# Altium schematic sheet IDC_MCX_Adapter.SchDoc: IDC MCX Adapter
size A3; CheckedBy: Maciej Przybysz; Author: Michał Piętka; Organization: Technosystem; Address1: Słoneczna 125, 05-506 Kolonia Lesznowola; Address2: https://technosystem.pl/; Address4: (NOT USED); DocumentNumber: 1; Revision: 0; SheetNumber: 1; SheetTotal: 1
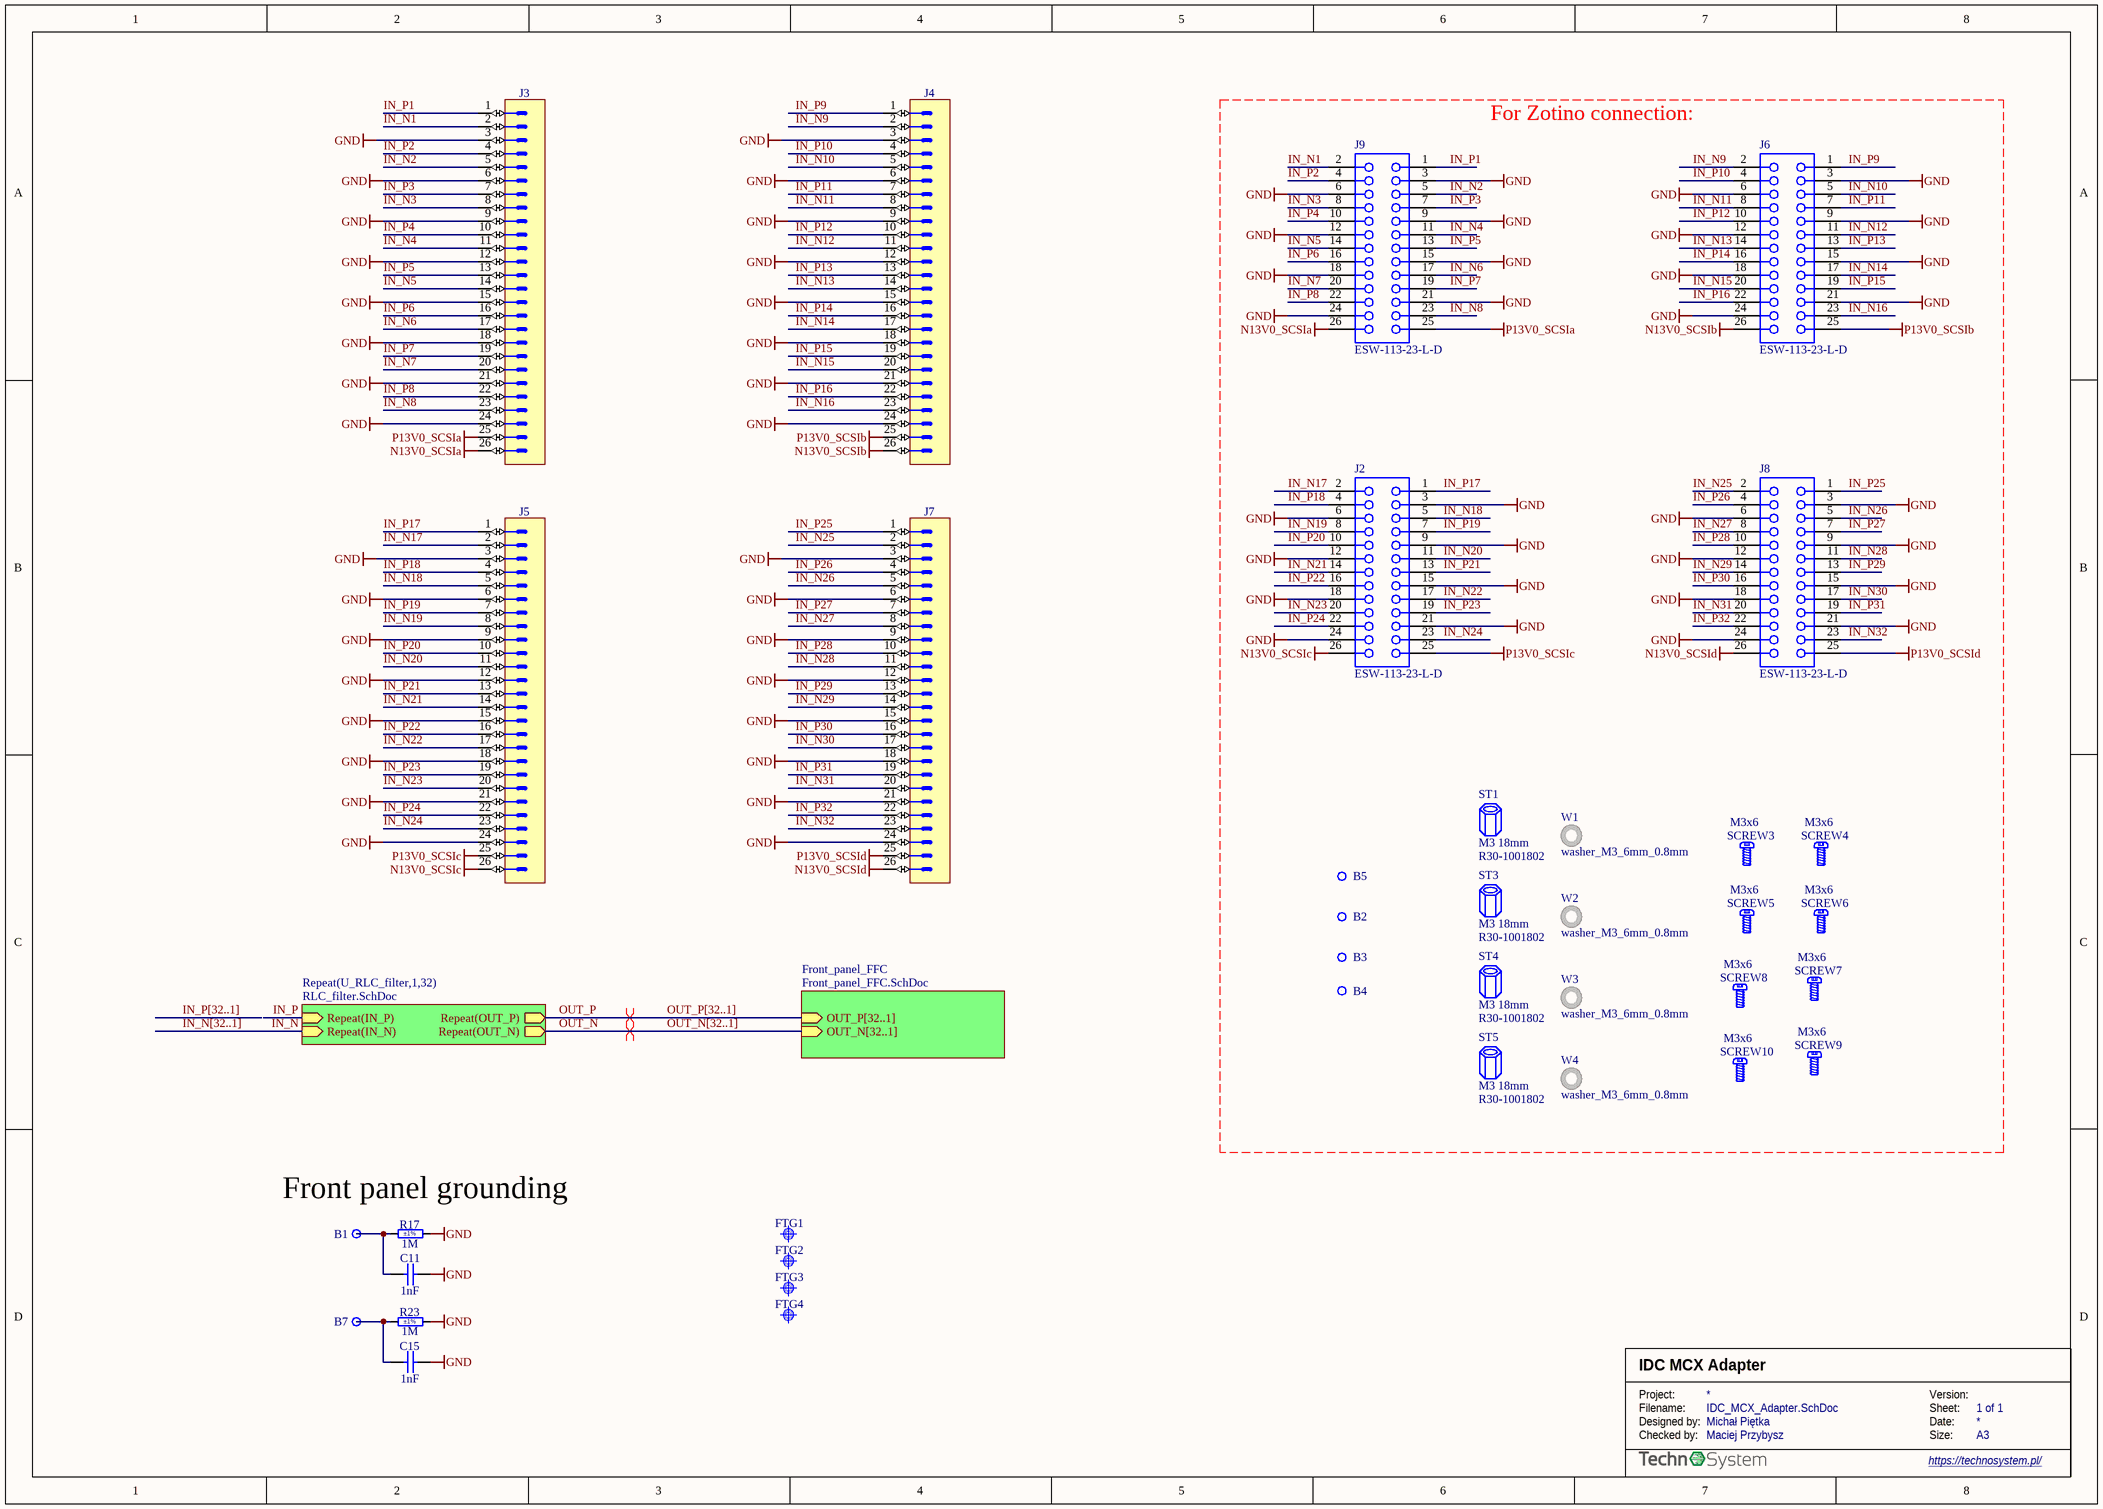
[diagram p0: IDC_MCX_Adapter.SchDoc]

## Parts
B1  Plated Hole  [MTG270_500]  (value not drawn)  (no BOM)
B2  Plated Hole  [MTG320_700]  (value not drawn)  (no BOM)
B3  Plated Hole  [MTG320_700]  (value not drawn)  (no BOM)
B4  Plated Hole  [MTG320_700]  (value not drawn)  (no BOM)
B5  Plated Hole  [MTG320_700]  (value not drawn)  (no BOM)
B7  Plated Hole  [MTG270_500]  (value not drawn)  (no BOM)
C11  1nF  [CAPC1608X87N]
C15  1nF  [CAPC1608X87N]
FTG1  Use only in PCB  [FIDUCIAL_TOP_C100-200]  (value not drawn)
FTG2  Use only in PCB  [FIDUCIAL_TOP_S100-200]  (value not drawn)
FTG3  Use only in PCB  [FIDUCIAL_TOP_S100-200]  (value not drawn)
FTG4  Use only in PCB  [FIDUCIAL_TOP_S100-200]  (value not drawn)
J2  ESW-113-23-L-D  [SMTC-ESW-113-23-X-D]
J3  Header 26  [3M_N2526-6002RB]  (value not drawn)
J4  Header 26  [3M_N2526-6002RB]  (value not drawn)
J5  Header 26  [3M_N2526-6002RB]  (value not drawn)
J6  ESW-113-23-L-D  [SMTC-ESW-113-23-X-D]
J7  Header 26  [3M_N2526-6002RB]  (value not drawn)
J8  ESW-113-23-L-D  [SMTC-ESW-113-23-X-D]
J9  ESW-113-23-L-D  [SMTC-ESW-113-23-X-D]
R17  1M  Tolerance: ±1%  [RESC1608X55N]
R23  1M  Tolerance: ±1%  [RESC1608X55N]
SCREW3  M3x6  [BOSSARD_BN5687-3061605_v]
SCREW4  M3x6  [BOSSARD_BN5687-3061605_v]
SCREW5  M3x6  [BOSSARD_BN5687-3061605_v]
SCREW6  M3x6  [BOSSARD_BN5687-3061605_v]
SCREW7  M3x6  [BOSSARD_BN5687-3061605_v]
SCREW8  M3x6  [BOSSARD_BN5687-3061605_v]
SCREW9  M3x6  [BOSSARD_BN5687-3061605_v]
SCREW10  M3x6  [BOSSARD_BN5687-3061605_v]
ST1  M3 18mm  [R30-1001802]
ST3  M3 18mm  [R30-1001802]
ST4  M3 18mm  [R30-1001802]
ST5  M3 18mm  [R30-1001802]
W1  washer_M3_6mm_0.8mm  [washer_M3_6mm_0.8mm]
W2  washer_M3_6mm_0.8mm  [washer_M3_6mm_0.8mm]
W3  washer_M3_6mm_0.8mm  [washer_M3_6mm_0.8mm]
W4  washer_M3_6mm_0.8mm  [washer_M3_6mm_0.8mm]

## Sub-sheets
Front_panel_FFC = Front_panel_FFC.SchDoc: OUT_P[32..1] (in), OUT_N[32..1] (in)
Repeat(U_RLC_filter,1,32) = RLC_filter.SchDoc: Repeat(IN_P) (in), Repeat(IN_N) (in), Repeat(OUT_P) (out), Repeat(OUT_N) (out)

## Nets
GND: C11.2 C15.2 J2.3 J2.6 J2.9 J2.12 J2.15 J2.18 J2.21 J2.24 J3.3 J3.6 J3.9 J3.12 J3.15 J3.18 J3.21 J3.24 J4.3 J4.6 J4.9 J4.12 J4.15 J4.18 J4.21 J4.24 J5.3 J5.6 J5.9 J5.12 J5.15 J5.18 J5.21 J5.24 J6.3 J6.6 J6.9 J6.12 J6.15 J6.18 J6.21 J6.24 J7.3 J7.6 J7.9 J7.12 J7.15 J7.18 J7.21 J7.24 J8.3 J8.6 J8.9 J8.12 J8.15 J8.18 J8.21 J8.24 J9.3 J9.6 J9.9 J9.12 J9.15 J9.18 J9.21 J9.24 R17.2 R23.2
N13V0_SCSIa: J3.26 J9.26
N13V0_SCSIb: J4.26 J6.26
N13V0_SCSIc: J2.26 J5.26
N13V0_SCSId: J7.26 J8.26
P13V0_SCSIa: J3.25 J9.25
P13V0_SCSIb: J4.25 J6.25
P13V0_SCSIc: J2.25 J5.25
P13V0_SCSId: J7.25 J8.25
IN_N: sheet Repeat(U_RLC_filter,1,32)/Repeat(IN_N)
IN_N1: J3.2 J9.2
IN_N2: J3.5 J9.5
IN_N3: J3.8 J9.8
IN_N4: J3.11 J9.11
IN_N5: J3.14 J9.14
IN_N6: J3.17 J9.17
IN_N7: J3.20 J9.20
IN_N8: J3.23 J9.23
IN_N9: J4.2 J6.2
IN_N10: J4.5 J6.5
IN_N11: J4.8 J6.8
IN_N12: J4.11 J6.11
IN_N13: J4.14 J6.14
IN_N14: J4.17 J6.17
IN_N15: J4.20 J6.20
IN_N16: J4.23 J6.23
IN_N17: J2.2 J5.2
IN_N18: J2.5 J5.5
IN_N19: J2.8 J5.8
IN_N20: J2.11 J5.11
IN_N21: J2.14 J5.14
IN_N22: J2.17 J5.17
IN_N23: J2.20 J5.20
IN_N24: J2.23 J5.23
IN_N25: J7.2 J8.2
IN_N26: J7.5 J8.5
IN_N27: J7.8 J8.8
IN_N28: J7.11 J8.11
IN_N29: J7.14 J8.14
IN_N30: J7.17 J8.17
IN_N31: J7.20 J8.20
IN_N32: J7.23 J8.23
IN_P: sheet Repeat(U_RLC_filter,1,32)/Repeat(IN_P)
IN_P1: J3.1 J9.1
IN_P2: J3.4 J9.4
IN_P3: J3.7 J9.7
IN_P4: J3.10 J9.10
IN_P5: J3.13 J9.13
IN_P6: J3.16 J9.16
IN_P7: J3.19 J9.19
IN_P8: J3.22 J9.22
IN_P9: J4.1 J6.1
IN_P10: J4.4 J6.4
IN_P11: J4.7 J6.7
IN_P12: J4.10 J6.10
IN_P13: J4.13 J6.13
IN_P14: J4.16 J6.16
IN_P15: J4.19 J6.19
IN_P16: J4.22 J6.22
IN_P17: J2.1 J5.1
IN_P18: J2.4 J5.4
IN_P19: J2.7 J5.7
IN_P20: J2.10 J5.10
IN_P21: J2.13 J5.13
IN_P22: J2.16 J5.16
IN_P23: J2.19 J5.19
IN_P24: J2.22 J5.22
IN_P25: J7.1 J8.1
IN_P26: J7.4 J8.4
IN_P27: J7.7 J8.7
IN_P28: J7.10 J8.10
IN_P29: J7.13 J8.13
IN_P30: J7.16 J8.16
IN_P31: J7.19 J8.19
IN_P32: J7.22 J8.22
OUT_N: sheet Repeat(U_RLC_filter,1,32)/Repeat(OUT_N)
OUT_P: sheet Repeat(U_RLC_filter,1,32)/Repeat(OUT_P)
NetB1_1: B1.1 C11.1 R17.1
NetB7_1: B7.1 C15.1 R23.1

Not connected (* = marked no-connect by the designer): B2 1; B3 1; B4 1; B5 1

## Buses and harness runs
bus IN_N[32..1]
bus IN_P[32..1]
bus OUT_N[32..1] = sheet Front_panel_FFC/OUT_N[32..1]
bus OUT_P[32..1] = sheet Front_panel_FFC/OUT_P[32..1]

## Layout directives
differential pair: OUT_N, OUT_P

## Notes on the sheet
- (near J6) For Zotino connection:
- Front panel grounding
- Project:
- Version:
- Designed by:
- Checked by:
- Filename:
- Size:
- Date:
- Sheet:
- A3

## Library data of the parts
B1 B7 = PLATED_HOLE2.7_PAD5.0: Single Terminal Socket; Part Description: Plated Through Hole: Hole Dia.=2.7mm Pad Dia.=5.0mm; Mounted: No; Part Number: PLATED_HOLE2.7_PAD5.0; Component Type: Standard (No BOM); Pin Count: 1; Family: Plated Hole; Socket: No; SMD: No; Sense: No; Status: None; ComponentHeight: 0mm; HelpURL: Undefined; Author: CERN DEM JMW; CreateDate: 27.09.2011; LatestRevisionDate: 27.09.2011; PackageDescription: Plated Through Hole: Hole Dia.=2.7mm Pad Dia.=5.0mm
B2-B5 = PLATED_HOLE3.2_PAD7.0: Single Terminal Socket; Part Description: Plated Through Hole: Hole Dia.=3.2mm Pad Dia.=7.0mm; Mounted: No; Part Number: PLATED_HOLE3.2_PAD7.0; Component Type: Standard (No BOM); Pin Count: 1; Family: Plated Hole; Socket: No; SMD: No; Sense: No; Status: None; ComponentHeight: 0mm; HelpURL: Undefined; Author: CERN DEM JMW; CreateDate: 28.11.2017; LatestRevisionDate: 28.11.2017; PackageDescription: Plated Through Hole: Hole Dia.=3.2mm Pad Dia.=7.0mm
C11 C15 = CC0603_1NF_50V_10%_X7R: Non-polarised capacitor; Part Description: SMD Multilayer Chip Ceramic Capacitor; Manufacturer: GENERIC; Manufacturer1 Part Number: 223858615623; Voltage: 50V; TC: X7R; Tolerance: ±10%; Part Number: CC0603_1NF_50V_10%_X7R; Component Kind: Standard; Component Type: Standard; Pin Count: 2; Value: 1nF; Status: Preferred; Manufacturer Part Number: CC0603_1NF_50V_10%_X7R; Case: 0603; Mounted: Yes; Socket: No; SMD: Yes; Sense: No; Manufacturer1 ComponentHeight: 0.87mm; HelpURL: \\cern.ch\dfs\Applications\Altium\Datasheets\CC0603_X7R_PHYCOMP.pdf; Author: CERN DEM JLC; CreateDate: 03.12.2007; LatestRevisionDate: 03.12.2007; Manufacturer1 Example: PHYCOMP
FTG1 = FIDUCIAL_TARGET_C100-200: Fiducial Target; Part Description: Round Fiducial Target, Top Layer, 1.0mm, Top Solder 2.0mm, Keepout =2.0mm; Mounted: No; Part Number: FIDUCIAL_TARGET_C100-200; Component Kind: Standard (No BOM); Component Type: Standard (No BOM); Pin Count: 1; Family: Fiducial; Socket: No; SMD: Yes; Sense: No; Status: None; ComponentHeight: 0mm; HelpURL: Undefined; Author: CERN DEM JLC; CreateDate: 09.02.2010; LatestRevisionDate: 04.04.2012; PackageDescription: Round Fiducial Target, Top Layer, 1.0mm, Top Solder 2.0mm, Keepout =2.0mm
FTG2-FTG4 = FIDUCIAL_TARGET_S100-200: Fiducial Target; Part Description: Square Fiducial Target, Top Layer, 1.0mm, Top Solder 2.0mm, Keepout =2.0mm; Mounted: No; Part Number: FIDUCIAL_TARGET_S100-200; Component Kind: Standard (No BOM); Component Type: Standard (No BOM); Pin Count: 1; Family: Fiducial; Socket: No; SMD: Yes; Sense: No; Status: None; ComponentHeight: 0mm; HelpURL: Undefined; Author: CERN DEM JLC; CreateDate: 09.02.2010; LatestRevisionDate: 04.04.2012; PackageDescription: Square Fiducial Target, Top Layer, 1.0mm, Top Solder 2.0mm, Keepout =2.0mm
J2 J6 J8 J9 = CMP-1023-00053-1: Elevated Socket, Through-hole, Vertical, -55 to 125 degC, 2.54 mm Pitch, 26-Pin, Female, RoHS; Manufacturer: Samtec; Pitch: 2.54 mm; PartNumber: ESW-113-23-L-D; Orientation: Vertical; PackageReference: ESW-113-23-X-D; ComponentLink3Description: Package Specification; Temperature Range: -55 to 125 degC; PackageDescription: ESW Strip ASM; RoHS: True; ComponentLink1Description: Manufacturer URL; Mounting Technology: Through-hole; ComponentLink2Description: Datasheet; ComponentLink3URL: http://www.samtec.com/documents/webfiles/cpdf/ESW-1XX-XX-X-X-XX-XX-MKT.pdf; PackageVersion: AV, 7/1985; ComponentLink1URL: http://www.samtec.com; ComponentLink2URL: http://www.samtec.com/documents/webfiles/pdf/ESW_TH.PDF; DatasheetVersion: F-214
J3-J5 J7 = 3M_N2526-6002RB: Connector 26 Male; Part Description: 26 Contacts - Straight .100'' x .100'' Low Profile Four-Wall Header, 2500 Series; Manufacturer: 3M; PressFit: No; Part Number: 3M_N2526-6002RB; Component Kind: Standard; Component Type: Standard; Pin Count: 26; Family: Header 26; Mounted: Yes; Socket: No; SMD: No; Sense: No; Status: None; Manufacturer Part Number: N2526-6002RB; ComponentHeight: 10.03mm; HelpURL: \\cern.ch\dfs\Applications\Altium\Datasheets\3M_N2526-6002RB.pdf; Author: CERN DEM JLC; CreateDate: 11.02.2009; LatestRevisionDate: 11.08.2009
R17 R23 = R0603_1M_1%_0.1W_100PPM: Resistor - 1%; Part Description: General Purpose Thick Film Chip Resistor; Manufacturer: GENERIC; Manufacturer1 Part Number: NRC06F1004TRF; PressFit: No; Power: 0.1W; TC: ±100ppm/°C; Part Number: R0603_1M_1%_0.1W_100PPM; Component Kind: Standard; Component Type: Standard; Pin Count: 2; Value: 1M; Status: Preferred; Manufacturer Part Number: R0603_1M_1%_0.1W_100PPM; Case: 0603; Mounted: Yes; Sense: No; Socket: No; SMD: Yes; Manufacturer1 Example: NIC COMPONENT; Manufacturer1 ComponentHeight: 0.55mm; HelpURL: \\cern.ch\dfs\Applications\Altium\Datasheets\R0603_NIC_NRC.pdf; Author: CERN DEM JLC; CreateDate: 03.12.2007; LatestRevisionDate: 13.03.2008
SCREW3-SCREW10 = BOSSARD_BN5687-3061605_v: Screw; Part Description: M3 L=6mm Hexalobular Socket Pan Head Screw, Fully Threaded, Stainless Steel A2; Manufacturer Part Number: BN5687 Art.3061605; PressFit: No; Part Number: BOSSARD_BN5687-3061605_v; Component Kind: Standard; Component Type: Mechanical; Pin Count: 0; PackageDescription: M3 L=6mm Hexalobular Socket Pan Head Screw, Fully Threaded - Stainless Steel A2; Mounted: Yes; Socket: No; SMD: No; Sense: No; Status: None; Value: M3x6; Manufacturer: BOSSARD; ComponentHeight: 2.4mm; HelpURL: \\cern.ch\dfs\Applications\Altium\Datasheets\BOSSARD_BN5687-3061605.pdf; Author: CERN DEM JLC; CreateDate: 15.01.2013; LatestRevisionDate: 15.01.2013
ST1 ST3-ST5 = STANDOFF_HARWIN_R30_1001802: M3.0x18 standoff; Manufacturer: Harwin; Manufacturer Part Number: R30-1001802
W1-W4 = washer_M3_6mm_0.8mm: M3 Washer: / ID: 3.2mm / OD: 6mm / Thickness 0.8mm; Manufacturer: Accu Limited; Manufacturer Part Number: HAFZ-M3-A4